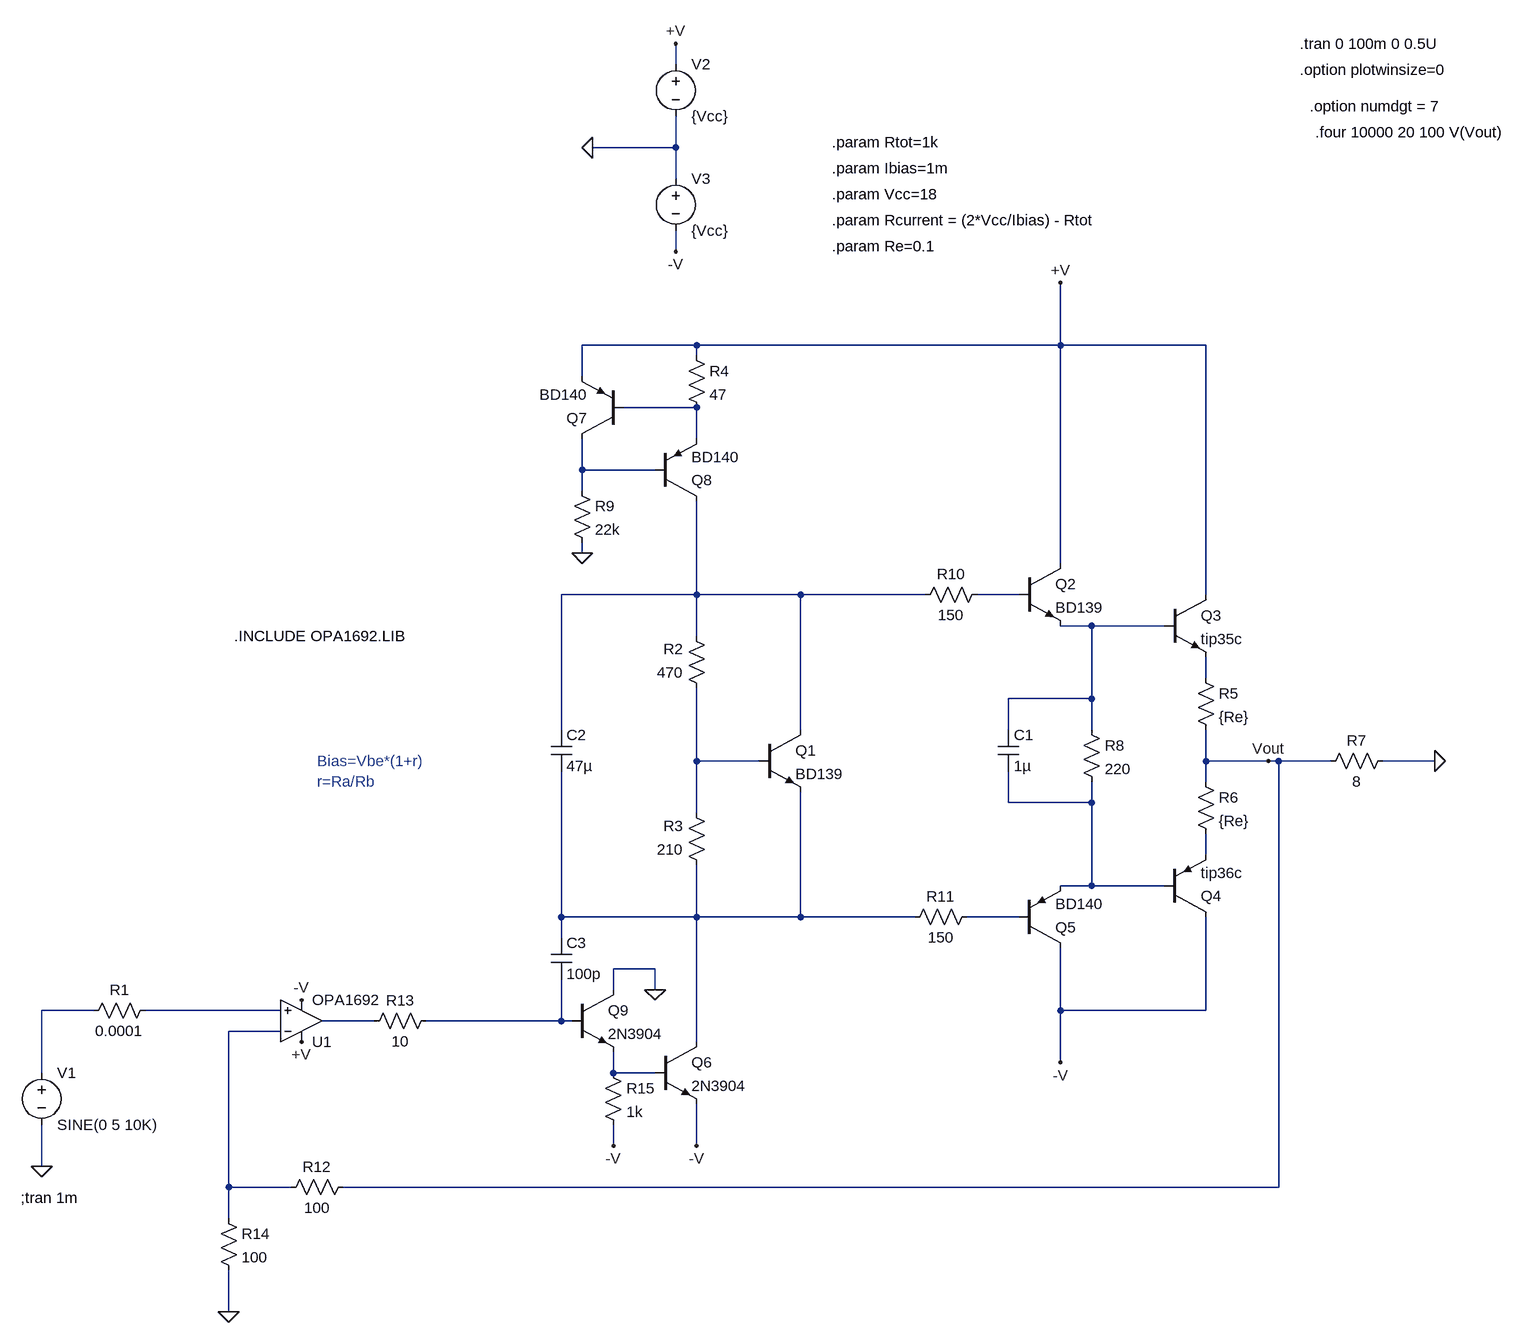
[diagram p0: schematic V6.asc]
V6.asc, the LTspice schematic file:
Version 4
SHEET 1 880 1316
WIRE -512 -624 -512 -656
WIRE -512 -496 -512 -544
WIRE -512 -496 -640 -496
WIRE -512 -448 -512 -496
WIRE -512 -336 -512 -368
WIRE -480 -192 -656 -192
WIRE 80 -192 80 -288
WIRE 80 -192 -480 -192
WIRE 304 -192 80 -192
WIRE -480 -176 -480 -192
WIRE -656 -144 -656 -192
WIRE -480 -96 -592 -96
WIRE -480 -48 -480 -96
WIRE -656 0 -656 -48
WIRE -544 0 -656 0
WIRE -656 32 -656 0
WIRE -656 128 -656 112
WIRE 80 144 80 -192
WIRE -480 192 -480 48
WIRE -480 192 -688 192
WIRE -320 192 -480 192
WIRE -128 192 -320 192
WIRE 16 192 -48 192
WIRE 304 192 304 -192
WIRE 128 240 80 240
WIRE 240 240 128 240
WIRE -480 256 -480 192
WIRE 304 320 304 288
WIRE 128 352 128 240
WIRE 128 352 0 352
WIRE -688 400 -688 192
WIRE -320 400 -320 192
WIRE 0 400 0 352
WIRE 128 400 128 352
WIRE -480 448 -480 336
WIRE -384 448 -480 448
WIRE 304 448 304 400
WIRE 400 448 304 448
WIRE 416 448 400 448
WIRE 496 448 416 448
WIRE 656 448 576 448
WIRE 304 480 304 448
WIRE 0 512 0 464
WIRE 128 512 128 480
WIRE 128 512 0 512
WIRE -480 528 -480 448
WIRE 304 592 304 560
WIRE 128 640 128 512
WIRE 128 640 80 640
WIRE 240 640 128 640
WIRE -688 688 -688 464
WIRE -480 688 -480 608
WIRE -480 688 -688 688
WIRE -320 688 -320 496
WIRE -320 688 -480 688
WIRE -144 688 -320 688
WIRE 16 688 -64 688
WIRE -688 720 -688 688
WIRE -544 768 -608 768
WIRE -608 800 -608 768
WIRE -544 800 -544 768
WIRE -1408 832 -1488 832
WIRE -1120 832 -1328 832
WIRE 80 832 80 736
WIRE 304 832 304 688
WIRE 304 832 80 832
WIRE -976 848 -1056 848
WIRE -688 848 -688 784
WIRE -688 848 -896 848
WIRE -672 848 -688 848
WIRE -1120 864 -1200 864
WIRE -480 880 -480 688
WIRE 80 912 80 832
WIRE -1488 928 -1488 832
WIRE -608 928 -608 896
WIRE -544 928 -608 928
WIRE -608 1040 -608 1008
WIRE -480 1040 -480 976
WIRE -1488 1072 -1488 1008
WIRE -1200 1104 -1200 864
WIRE -1104 1104 -1200 1104
WIRE 416 1104 416 448
WIRE 416 1104 -1024 1104
WIRE -1200 1152 -1200 1104
WIRE -1200 1296 -1200 1232
FLAG 80 -288 +V
FLAG 80 912 -V
FLAG -1488 1072 0
FLAG -640 -496 0
FLAG -512 -656 +V
FLAG -512 -336 -V
FLAG 656 448 0
FLAG 400 448 Vout
FLAG -480 1040 -V
FLAG -1088 880 +V
FLAG -1088 816 -V
FLAG -656 128 0
FLAG -1200 1296 0
FLAG -544 800 0
FLAG -608 1040 -V
SYMBOL voltage -1488 912 R0
WINDOW 123 0 0 Left 0
WINDOW 39 0 0 Left 0
SYMATTR InstName V1
SYMATTR Value SINE(0 5 10K)
SYMBOL res -1312 816 R90
WINDOW 0 0 56 VBottom 2
WINDOW 3 32 56 VTop 2
SYMATTR InstName R1
SYMATTR Value 0.0001
SYMBOL res -464 352 R180
WINDOW 0 36 76 Left 2
WINDOW 3 36 40 Left 2
SYMATTR InstName R2
SYMATTR Value 470
SYMBOL res -464 624 R180
WINDOW 0 36 76 Left 2
WINDOW 3 36 40 Left 2
SYMATTR InstName R3
SYMATTR Value 210
SYMBOL npn -384 400 R0
SYMATTR InstName Q1
SYMATTR Value BD139
SYMBOL npn 16 144 R0
SYMATTR InstName Q2
SYMATTR Value BD139
SYMBOL npn 240 192 R0
SYMATTR InstName Q3
SYMATTR Value tip35c
SYMBOL pnp 240 688 M180
SYMATTR InstName Q4
SYMATTR Value tip36c
SYMBOL pnp 16 736 M180
SYMATTR InstName Q5
SYMATTR Value BD140
SYMBOL res 288 304 R0
SYMATTR InstName R5
SYMATTR Value {Re}
SYMBOL res 288 464 R0
SYMATTR InstName R6
SYMATTR Value {Re}
SYMBOL voltage -512 -640 R0
WINDOW 123 0 0 Left 0
WINDOW 39 0 0 Left 0
SYMATTR InstName V2
SYMATTR Value {Vcc}
SYMBOL voltage -512 -464 R0
WINDOW 123 0 0 Left 0
WINDOW 39 0 0 Left 0
SYMATTR InstName V3
SYMATTR Value {Vcc}
SYMBOL res 592 432 R90
WINDOW 0 0 56 VBottom 2
WINDOW 3 32 56 VTop 2
SYMATTR InstName R7
SYMATTR Value 8
SYMBOL res -32 176 R90
WINDOW 0 0 56 VBottom 2
WINDOW 3 32 56 VTop 2
SYMATTR InstName R10
SYMATTR Value 150
SYMBOL res -48 672 R90
WINDOW 0 0 56 VBottom 2
WINDOW 3 32 56 VTop 2
SYMATTR InstName R11
SYMATTR Value 150
SYMBOL res 112 384 R0
SYMATTR InstName R8
SYMATTR Value 220
SYMBOL cap -16 400 R0
SYMATTR InstName C1
SYMATTR Value 1µ
SYMBOL cap -704 400 R0
SYMATTR InstName C2
SYMATTR Value 47µ
SYMBOL OpAmps\\opamp2 -1088 912 M180
SYMATTR InstName U1
SYMATTR Value OPA1692
SYMBOL res -1008 1088 R90
WINDOW 0 0 56 VBottom 2
WINDOW 3 32 56 VTop 2
SYMATTR InstName R12
SYMATTR Value 100
SYMBOL res -880 832 R90
WINDOW 0 0 56 VBottom 2
WINDOW 3 32 56 VTop 2
SYMATTR InstName R13
SYMATTR Value 10
SYMBOL pnp -592 -48 R180
SYMATTR InstName Q7
SYMATTR Value BD140
SYMBOL res -496 -192 R0
SYMATTR InstName R4
SYMATTR Value 47
SYMBOL pnp -544 48 M180
SYMATTR InstName Q8
SYMATTR Value BD140
SYMBOL res -672 16 R0
SYMATTR InstName R9
SYMATTR Value 22k
SYMBOL res -1216 1136 R0
SYMATTR InstName R14
SYMATTR Value 100
SYMBOL npn -544 880 R0
SYMATTR InstName Q6
SYMATTR Value 2N3904
SYMBOL npn -672 800 R0
SYMATTR InstName Q9
SYMATTR Value 2N3904
SYMBOL res -624 912 R0
SYMATTR InstName R15
SYMATTR Value 1k
SYMBOL cap -704 720 R0
SYMATTR InstName C3
SYMATTR Value 100p
TEXT -1064 448 Left 2 ;Bias=Vbe*(1+r)\nr=Ra/Rb
TEXT -272 -504 Left 2 !.param Rtot=1k
TEXT -272 -464 Left 2 !.param Ibias=1m
TEXT -272 -424 Left 2 !.param Vcc=18
TEXT -272 -384 Left 2 !.param Rcurrent = (2*Vcc/Ibias) - Rtot
TEXT -272 -344 Left 2 !.param Re=0.1
TEXT -1520 1120 Left 2 !;tran 1m
TEXT 448 -656 Left 2 !.tran 0 100m 0 0.5U
TEXT 448 -616 Left 2 !.option plotwinsize=0
TEXT 464 -560 Left 2 !.option numdgt = 7
TEXT 472 -520 Left 2 !.four 10000 20 100 V(Vout)
TEXT -1192 256 Left 2 !.INCLUDE OPA1692.LIB

The netlist it stands for:
* V6.asc
V1 N012 0 SINE(0 5 10K)
R1 N013 N012 0.0001
R2 N007 N003 470
R3 N010 N007 210
Q1 N003 N007 N010 0 BD139
Q2 +V N004 N005 0 BD139
Q3 +V N005 N006 0 tip35c
Q4 -V N008 N009 0 tip36c
Q5 -V N011 N008 0 BD140
R5 N006 Vout {Re}
R6 Vout N009 {Re}
V2 +V 0 {Vcc}
V3 0 -V {Vcc}
R7 0 Vout 8
R10 N004 N003 150
R11 N011 N010 150
R8 N005 N008 220
C1 N005 N008 1µ
C2 N003 N010 47µ
XU1 N013 N016 +V -V N014 OPA1692  ; pins In+ In- V+ V- OUT
R12 Vout N016 100
R13 N015 N014 10
Q7 N002 N001 +V 0 BD140
R4 +V N001 47
Q8 N003 N002 N001 0 BD140
R9 N002 0 22k
R14 N016 0 100
Q6 N010 N017 -V 0 2N3904
Q9 0 N015 N017 0 2N3904
R15 N017 -V 1k
C3 N010 N015 100p
.model NPN NPN
.model PNP PNP
.lib standard.bjt
* Bias=Vbe*(1+r)
* r=Ra/Rb
.param Rtot=1k
.param Ibias=1m
.param Vcc=18
.param Rcurrent = (2*Vcc/Ibias) - Rtot
.param Re=0.1
;tran 1m
.tran 0 100m 0 0.5U
.option plotwinsize=0
.option numdgt = 7
.four 10000 20 100 V(Vout)
.INCLUDE OPA1692.LIB
.backanno
.end